# Altium schematic sheet ZynqPower.SchDoc
size A3; Author: Carlos Barreiro; Organization: Escuela Técnica Superior de Ingeniería de Sistemas Informáticos de la Universidad Politécnica de Madrid; Address1: Campus Sur de la Universidad Politécnica de Madrid; Address2: Calle de Alan Turing, s/nº; Address3: Madrid 28031; Address4: España; DocumentNumber: 9; SheetNumber: 9; SheetTotal: 16
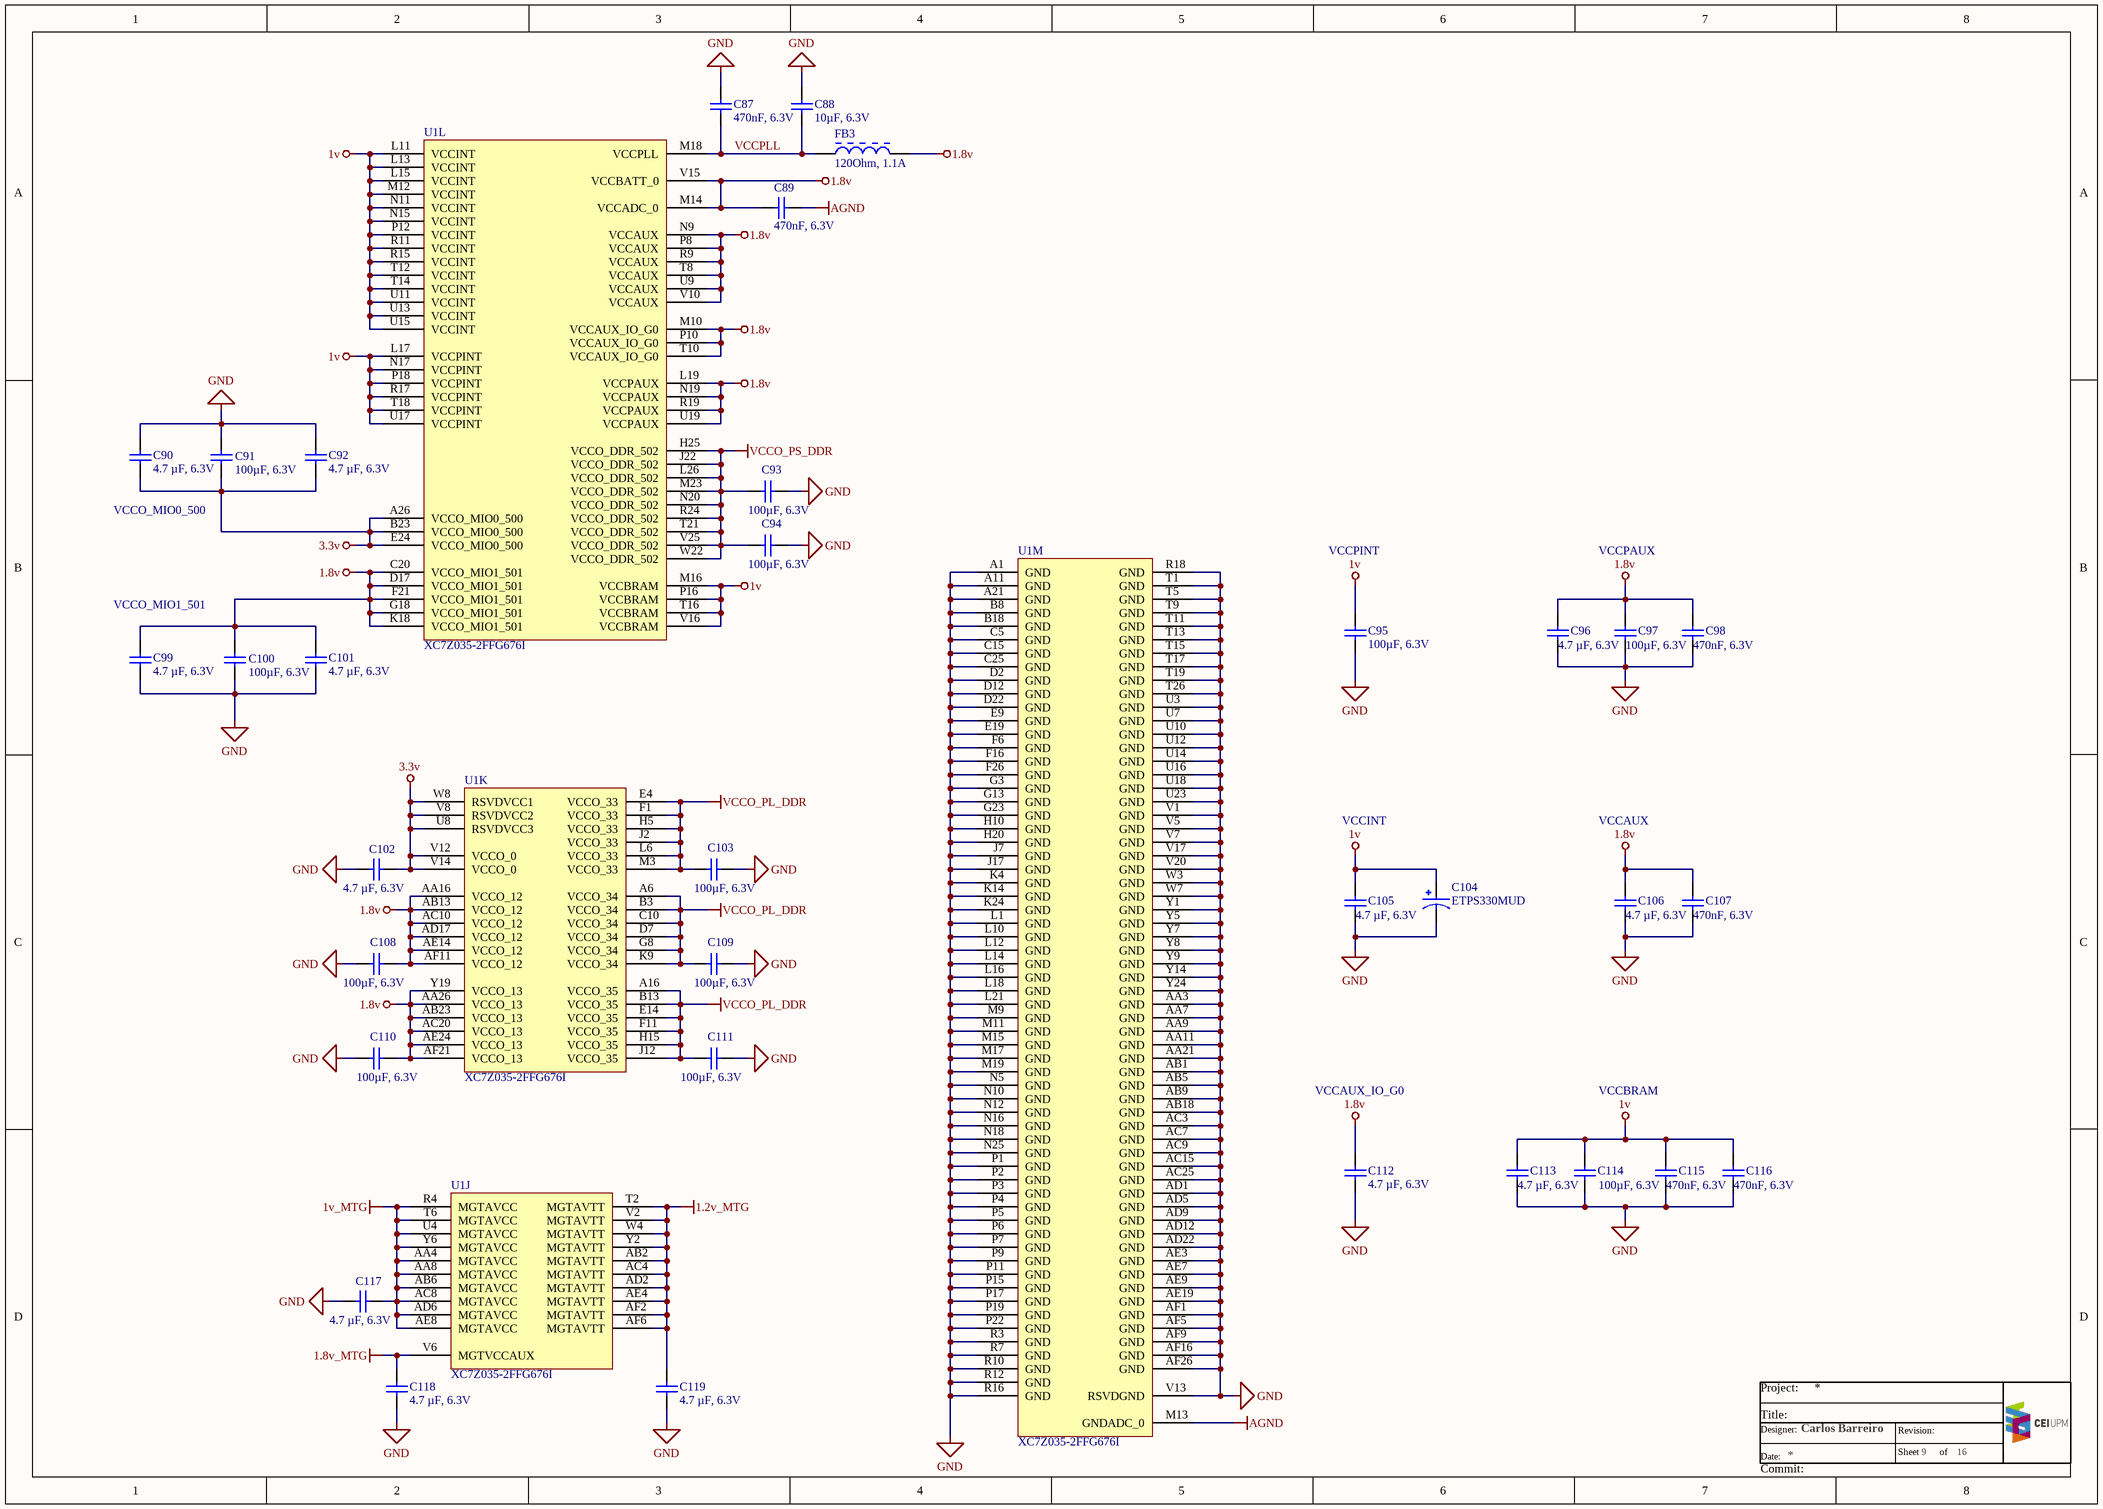
[diagram p0: ZynqPower.SchDoc]

## Parts
C87  470nF, 6.3V  [WURTH_WCAP-CSGP_0402]
C88  10µF, 6.3V  [WURTH_WCAP-CSGP_0402]
C89  470nF, 6.3V  [WURTH_WCAP-CSGP_0402]
C90  4.7 µF, 6.3V  [WURTH_WCAP-CSGP_0402]
C91  100µF, 6.3V  [WURTH_WCAP-CSGP_1206_H=1.6mm]
C92  4.7 µF, 6.3V  [WURTH_WCAP-CSGP_0402]
C93  100µF, 6.3V  [WURTH_WCAP-CSGP_1206_H=1.6mm]
C94  100µF, 6.3V  [WURTH_WCAP-CSGP_1206_H=1.6mm]
C95  100µF, 6.3V  [WURTH_WCAP-CSGP_1206_H=1.6mm]
C96  4.7 µF, 6.3V  [WURTH_WCAP-CSGP_0402]
C97  100µF, 6.3V  [WURTH_WCAP-CSGP_1206_H=1.6mm]
C98  470nF, 6.3V  [WURTH_WCAP-CSGP_0402]
C99  4.7 µF, 6.3V  [WURTH_WCAP-CSGP_0402]
C100  100µF, 6.3V  [WURTH_WCAP-CSGP_1206_H=1.6mm]
C101  4.7 µF, 6.3V  [WURTH_WCAP-CSGP_0402]
C102  4.7 µF, 6.3V  [WURTH_WCAP-CSGP_0402]
C103  100µF, 6.3V  [WURTH_WCAP-CSGP_1206_H=1.6mm]
C104  ETPS330MUD  [PANASONIC_B1S]
C105  4.7 µF, 6.3V  [WURTH_WCAP-CSGP_0402]
C106  4.7 µF, 6.3V  [WURTH_WCAP-CSGP_0402]
C107  470nF, 6.3V  [WURTH_WCAP-CSGP_0402]
C108  100µF, 6.3V  [WURTH_WCAP-CSGP_1206_H=1.6mm]
C109  100µF, 6.3V  [WURTH_WCAP-CSGP_1206_H=1.6mm]
C110  100µF, 6.3V  [WURTH_WCAP-CSGP_1206_H=1.6mm]
C111  100µF, 6.3V  [WURTH_WCAP-CSGP_1206_H=1.6mm]
C112  4.7 µF, 6.3V  [WURTH_WCAP-CSGP_0402]
C113  4.7 µF, 6.3V  [WURTH_WCAP-CSGP_0402]
C114  100µF, 6.3V  [WURTH_WCAP-CSGP_1206_H=1.6mm]
C115  470nF, 6.3V  [WURTH_WCAP-CSGP_0402]
C116  470nF, 6.3V  [WURTH_WCAP-CSGP_0402]
C117  4.7 µF, 6.3V  [WURTH_WCAP-CSGP_0402]
C118  4.7 µF, 6.3V  [WURTH_WCAP-CSGP_0402]
C119  4.7 µF, 6.3V  [WURTH_WCAP-CSGP_0402]
FB3  120Ohm, 1.1A  [WURTH-CBF_0402]
U1  XC7Z035-2FFG676I  [XILINX_FBG676]  (parts J,K,L,M of 13)

## Nets
1.2v_MTG: C119.2 U1.AB2(MGTAVTT) U1.AC4(MGTAVTT) U1.AD2(MGTAVTT) U1.AE4(MGTAVTT) U1.AF2(MGTAVTT) U1.AF6(MGTAVTT) U1.T2(MGTAVTT) U1.V2(MGTAVTT) U1.W4(MGTAVTT) U1.Y2(MGTAVTT)
1.8v: C89.2 C96.1 C97.2 C98.2 C99.2 C100.1 C101.2 C106.2 C107.2 C108.1 C110.1 C112.2 FB3.2 U1.AA16(VCCO_12) U1.AA26(VCCO_13) U1.AB13(VCCO_12) U1.AB23(VCCO_13) U1.AC10(VCCO_12) U1.AC20(VCCO_13) U1.AD17(VCCO_12) U1.AE14(VCCO_12) U1.AE24(VCCO_13) U1.AF11(VCCO_12) U1.AF21(VCCO_13) U1.C20(VCCO_MIO1_501) U1.D17(VCCO_MIO1_501) U1.F21(VCCO_MIO1_501) U1.G18(VCCO_MIO1_501) U1.K18(VCCO_MIO1_501) U1.L19(VCCPAUX) U1.M10(VCCAUX_IO_G0) U1.M14(VCCADC_0) U1.N9(VCCAUX) U1.N19(VCCPAUX) U1.P8(VCCAUX) U1.P10(VCCAUX_IO_G0) U1.R9(VCCAUX) U1.R19(VCCPAUX) U1.T8(VCCAUX) U1.T10(VCCAUX_IO_G0) U1.U9(VCCAUX) U1.U19(VCCPAUX) U1.V10(VCCAUX) U1.V15(VCCBATT_0) U1.Y19(VCCO_13)
1.8v_MTG: C118.2 U1.V6(MGTVCCAUX)
1v: C95.2 C104.1 C105.1 C113.1 C114.2 C115.2 C116.2 U1.L11(VCCINT) U1.L13(VCCINT) U1.L15(VCCINT) U1.L17(VCCPINT) U1.M12(VCCINT) U1.M16(VCCBRAM) U1.N11(VCCINT) U1.N15(VCCINT) U1.N17(VCCPINT) U1.P12(VCCINT) U1.P16(VCCBRAM) U1.P18(VCCPINT) U1.R11(VCCINT) U1.R15(VCCINT) U1.R17(VCCPINT) U1.T12(VCCINT) U1.T14(VCCINT) U1.T16(VCCBRAM) U1.T18(VCCPINT) U1.U11(VCCINT) U1.U13(VCCINT) U1.U15(VCCINT) U1.U17(VCCPINT) U1.V16(VCCBRAM)
1v_MTG: C117.2 U1.AA4(MGTAVCC) U1.AA8(MGTAVCC) U1.AB6(MGTAVCC) U1.AC8(MGTAVCC) U1.AD6(MGTAVCC) U1.AE8(MGTAVCC) U1.R4(MGTAVCC) U1.T6(MGTAVCC) U1.U4(MGTAVCC) U1.Y6(MGTAVCC)
3.3v: C90.2 C91.1 C92.2 C102.2 U1.A26(VCCO_MIO0_500) U1.B23(VCCO_MIO0_500) U1.E24(VCCO_MIO0_500) U1.U8(RSVDVCC3) U1.V8(RSVDVCC2) U1.V12(VCCO_0) U1.V14(VCCO_0) U1.W8(RSVDVCC1)
AGND: C89.1 U1.M13(GNDADC_0)
GND: C87.2 C88.2 C90.1 C91.2 C92.1 C93.2 C94.2 C95.1 C96.2 C97.1 C98.1 C99.1 C100.2 C101.1 C102.1 C103.2 C104.2 C105.2 C106.1 C107.1 C108.2 C109.2 C110.2 C111.2 C112.1 C113.2 C114.1 C115.1 C116.1 C117.1 C118.1 C119.1 U1.A1(GND) U1.A11(GND) U1.A21(GND) U1.AA3(GND) U1.AA7(GND) U1.AA9(GND) U1.AA11(GND) U1.AA21(GND) U1.AB1(GND) U1.AB5(GND) U1.AB9(GND) U1.AB18(GND) U1.AC3(GND) U1.AC7(GND) U1.AC9(GND) U1.AC15(GND) U1.AC25(GND) U1.AD1(GND) U1.AD5(GND) U1.AD9(GND) U1.AD12(GND) U1.AD22(GND) U1.AE3(GND) U1.AE7(GND) U1.AE9(GND) U1.AE19(GND) U1.AF1(GND) U1.AF5(GND) U1.AF9(GND) U1.AF16(GND) U1.AF26(GND) U1.B8(GND) U1.B18(GND) U1.C5(GND) U1.C15(GND) U1.C25(GND) U1.D2(GND) U1.D12(GND) U1.D22(GND) U1.E9(GND) U1.E19(GND) U1.F6(GND) U1.F16(GND) U1.F26(GND) U1.G3(GND) U1.G13(GND) U1.G23(GND) U1.H10(GND) U1.H20(GND) U1.J7(GND) U1.J17(GND) U1.K4(GND) U1.K14(GND) U1.K24(GND) U1.L1(GND) U1.L10(GND) U1.L12(GND) U1.L14(GND) U1.L16(GND) U1.L18(GND) U1.L21(GND) U1.M9(GND) U1.M11(GND) U1.M15(GND) U1.M17(GND) U1.M19(GND) U1.N5(GND) U1.N10(GND) U1.N12(GND) U1.N16(GND) U1.N18(GND) U1.N25(GND) U1.P1(GND) U1.P2(GND) U1.P3(GND) U1.P4(GND) U1.P5(GND) U1.P6(GND) U1.P7(GND) U1.P9(GND) U1.P11(GND) U1.P15(GND) U1.P17(GND) U1.P19(GND) U1.P22(GND) U1.R3(GND) U1.R7(GND) U1.R10(GND) U1.R12(GND) U1.R16(GND) U1.R18(GND) U1.T1(GND) U1.T5(GND) U1.T9(GND) U1.T11(GND) U1.T13(GND) U1.T15(GND) U1.T17(GND) U1.T19(GND) U1.T26(GND) U1.U3(GND) U1.U7(GND) U1.U10(GND) U1.U12(GND) U1.U14(GND) U1.U16(GND) U1.U18(GND) U1.U23(GND) U1.V1(GND) U1.V5(GND) U1.V7(GND) U1.V13(RSVDGND) U1.V17(GND) U1.V20(GND) U1.W3(GND) U1.W7(GND) U1.Y1(GND) U1.Y5(GND) U1.Y7(GND) U1.Y8(GND) U1.Y9(GND) U1.Y14(GND) U1.Y24(GND)
VCCO_PL_DDR: C103.1 C109.1 C111.1 U1.A6(VCCO_34) U1.A16(VCCO_35) U1.B3(VCCO_34) U1.B13(VCCO_35) U1.C10(VCCO_34) U1.D7(VCCO_34) U1.E4(VCCO_33) U1.E14(VCCO_35) U1.F1(VCCO_33) U1.F11(VCCO_35) U1.G8(VCCO_34) U1.H5(VCCO_33) U1.H15(VCCO_35) U1.J2(VCCO_33) U1.J12(VCCO_35) U1.K9(VCCO_34) U1.L6(VCCO_33) U1.M3(VCCO_33)
VCCO_PS_DDR: C93.1 C94.1 U1.H25(VCCO_DDR_502) U1.J22(VCCO_DDR_502) U1.L26(VCCO_DDR_502) U1.M23(VCCO_DDR_502) U1.N20(VCCO_DDR_502) U1.R24(VCCO_DDR_502) U1.T21(VCCO_DDR_502) U1.V25(VCCO_DDR_502) U1.W22(VCCO_DDR_502)
VCCPLL: C87.1 C88.1 FB3.1 U1.M18(VCCPLL)

## Notes on the sheet
- VCCO_MIO0_500
- VCCPINT
- VCCPAUX
- VCCO_MIO1_501
- VCCINT
- VCCAUX
- VCCAUX_IO_G0
- VCCBRAM
- Project:
- Title:
- Date:
- Designer:
- Sheet
- Revision:
- of
- Commit:

## Library data of the parts
C87 C89 C98 C107 C115 C116 = 885012105004: WCAP-CSGP Multilayer Ceramic Chip Capacitor, General Purpose, size 0402, X5R, 470nF, 6.3V; Manufacturer: Wurth Elektronik; Rated Voltage: 6.3VDC; Isolation Resistance  min.: 0.2GOhm; Capacitance Tolerance: +/-20%; Dissipation Factor max.: 10%; Technical Reference: X5R0402474M6R3DFCT10000; ComponentLink1Description: Manufacturer; ComponentLink1URL: http://www.we-online.de; ComponentLink2Description: Datasheet; ComponentLink2URL: https://www.we-online.com/catalog/datasheet/885012105004.pdf; Operating Temperature: -55 to +85degC; Packaging: Tape and Reel; Manufacturer Part Number: 885012105004; Published Date: April 2021; Ceramic Type: X5R; Height: 0.5mm; Mounting Technology: SMT; Size: 0402; Capacitance: 470nF; Supplier 1: Digi-Key; Supplier 2: Mouser; Supplier Part Number 1: 732-7481-1-ND; Supplier Part Number 2: 710-885012105004
C88 = 885012105020: WCAP-CSGP Multilayer Ceramic Chip Capacitor, General Purpose, size 0402, X5R, 10uF, 6.3V; Manufacturer: Wurth Elektronik; Rated Voltage: 6.3VDC; Isolation Resistance  min.: 0.01GOhm; Capacitance Tolerance: +/20%; Dissipation Factor max.: 10%; Technical Reference: X5R0402106M6R3DFCT10000; ComponentLink1Description: Manufacturer; ComponentLink1URL: http://www.we-online.de; ComponentLink2Description: Datasheet; ComponentLink2URL: https://www.we-online.com/catalog/datasheet/885012105020.pdf; Operating Temperature: -55 to +85degC; Packaging: Tape and Reel; Manufacturer Part Number: 885012105020; Published Date: April 2021; Ceramic Type: X5R; Height: 0.5mm; Mounting Technology: SMT; Size: 0402; Capacitance: 10uF; Q-Factor min.: -
C90 C92 C96 C99 C101 C102 C105 C106 C112 C113 C117-C119 = GRM155C80J475MEAAD: Multilayer Ceramic Capacitors MLCC, size 0402, X5R, 4.7 µF, 6.3V; Manufacturer: Murata; Rated Voltage: 6.3VDC; Ceramic Type: X6S; Capacitance Tolerance: +/-20%; Dissipation Factor max.: 10%; Capacitance: 4.7 µF; Operating Temperature: -55 to +105degC; Packaging: Tape and Reel; Manufacturer Part Number: GRM155C80J475MEAAD; Height: 0.5mm; Mounting Technology: SMT; Size: 0402; Supplier 1: Digi-Key; Supplier 2: Mouser; Supplier Part Number 1: 490-14458-1-ND; Supplier Part Number 2: 81-GRM155C80J475MEAD
C91 C93-C95 C97 C100 C103 C108-C111 C114 = 885012108005: WCAP-CSGP Multilayer Ceramic Chip Capacitor, General Purpose, size 1206, X5R, 100uF, 6.3V; Manufacturer: Wurth Elektronik; Rated Voltage: 6.3VDC; Isolation Resistance  min.: 0.001GOhm; Capacitance Tolerance: +/-20%; Dissipation Factor max.: 10%; Technical Reference: X5R1206107M6R3DFCT10000; ComponentLink1Description: Manufacturer; ComponentLink1URL: http://www.we-online.de; ComponentLink2Description: Datasheet; ComponentLink2URL: https://www.we-online.com/catalog/datasheet/885012108005.pdf; Operating Temperature: -55 to +85degC; Packaging: Tape and Reel; Manufacturer Part Number: 885012108005; Published Date: April 2021; Ceramic Type: X5R; Height: 1.6mm; Mounting Technology: SMT; Size: 1206; Capacitance: 100uF; Q-Factor min.: -
C104 = ETPS330MUD: Conductive Polymer Tantalum Solid Capacitors; Rated capacitance range (µF): 330.00; Rated voltage (DC) (V): 2.50; MF: Panasonic; Package: B1S; MP: ETPS330MUD; Supplier 1: Digi-Key; Supplier Part Number 1: 10-ETPS330MUDDKR-ND
FB3 = 74279271: WE-CBF SMT EMI Suppression Ferrite Bead, size 0402, 120Ohm, 1.1A; Manufacturer: Wurth Elektronik; Impedance max.: 200Ohm; DC Resistance max.: 0.2Ohm; Type: Wide Band; ComponentLink1Description: Manufacturer; ComponentLink1URL: http://www.we-online.de; ComponentLink2Description: Datasheet; ComponentLink2URL: https://www.we-online.com/catalog/datasheet/74279271.pdf; Operating Temperature: -55 to +125degC; Packaging: Tape and Reel; Published Date: December 2021; Rated Current: 1.1A; Manufacturer Part Number: 74279271; Impedance @100MHz: 120Ohm; Mounting Technology: SMT; Size: 0402; Height: 0.5mm; Length: 1mm; Width: 0.5mm
U1 = XC7Z035-2FFG676I: 667 MHz Zynq™-7000 AP SoC, 130 PS I/O, 254 FPGA I/O, 676-Ball BGA, Speed Grade 1, Commercial Grade, Pb-Free; PartNumber: XC7Z035-2FBG676I; LUTs: 171,900; Extensible Block RAM (# 36Kb Blocks): 17.6Mb (500); Speed Grade: -2; Flip Flops: 343,800; ComponentLink5Description: Packaging and Pinout; ComponentLink4Description: Package File; ComponentLink5URL: http://www.xilinx.com/support/documentation/user_guides/ug865-Zynq-7000-Pkg-Pinout.pdf; Generic Part Number: XC7Z035; ComponentLink1Description: Datasheet; ComponentLink2Description: Package Specification; ComponentLink3URL: http://www.xilinx.com/support/documentation/data_sheets/ds191-XC7Z030-XC7Z045-data-sheet.pdf; ComponentLink1URL: http://www.xilinx.com/support/documentation/data_sheets/ds190-Zynq-7000-Overview.pdf; ComponentLink6Description: PCB and Layout Guide; Package: FBG676; ComponentLink3Description: DC and AC Switching Characteristics; ComponentLink6URL: http://www.xilinx.com/support/documentation/user_guides/ug483_7Series_PCB.pdf; RoHS: Pb-Free; ComponentLink4URL: http://www.xilinx.com/support/packagefiles/z7packages/xc7z030fbg676pkg.txt; ComponentLink2URL: http://www.xilinx.com/support/documentation/user_guides/ug475_7Series_Pkg_Pinout.pdf; PackageDescription: Flip-Chip Lidless BGA, Body 27 x 27 mm, 1.0 mm Pitch; Supplier 1: Digi-Key; Supplier 2: Mouser; Supplier Part Number 1: XC7Z035-2FFG676I-ND; Supplier Part Number 2: 217-XC7Z035-2FFG676I